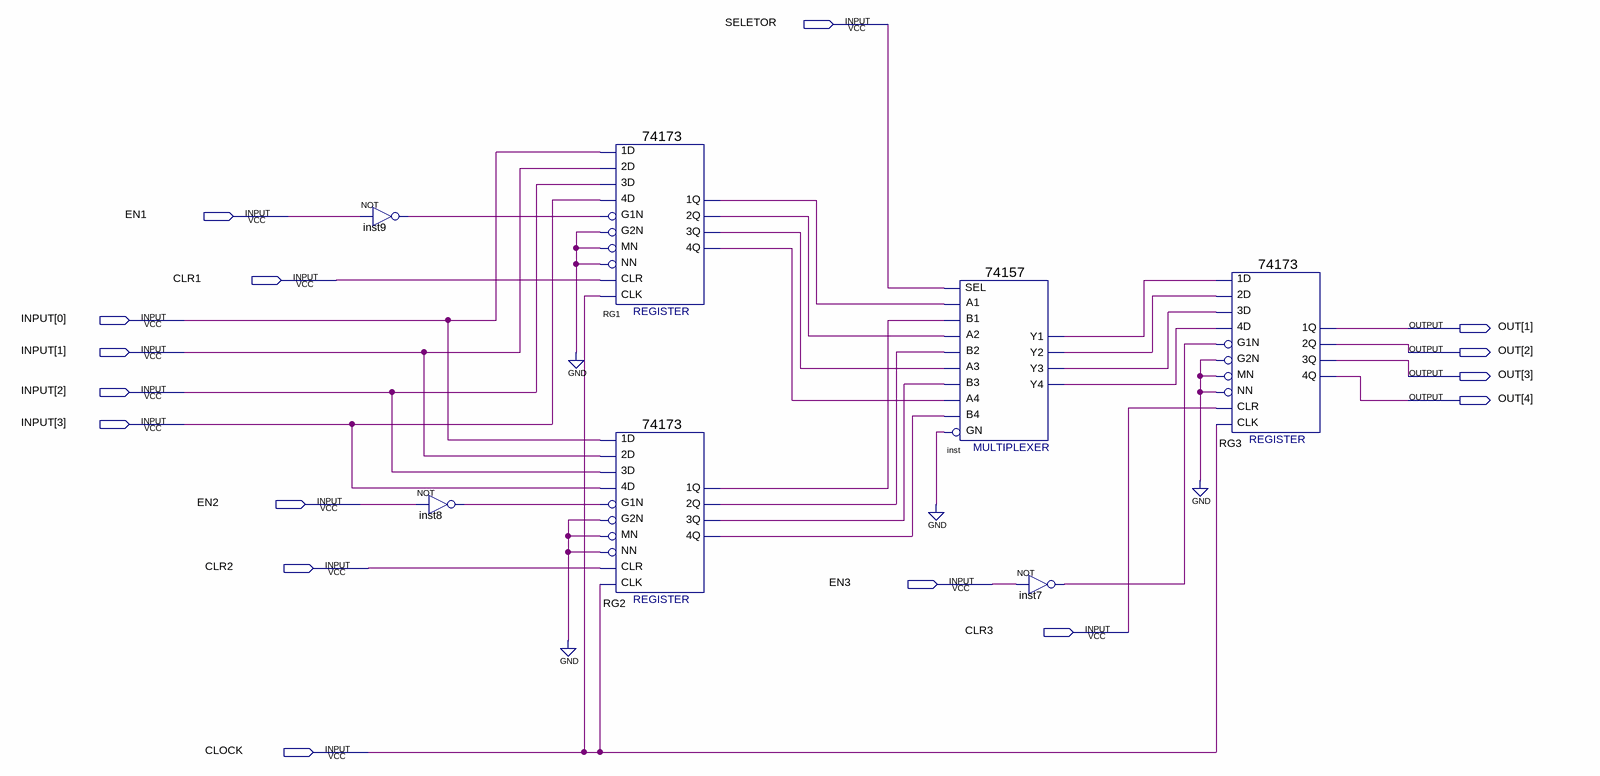
[diagram p0: schematic sheet]
// Quartus schematic Fluxo.bdf as structural Verilog: 7 symbols, 16 pins
module Fluxo (
  input  SELETOR,
  input  EN1,
  input  CLR1,
  input  [3:0] INPUT,
  input  EN2,
  input  CLR2,
  input  EN3,
  input  CLR3,
  input  CLOCK,
  output [4:1] OUT
);

  wire inst7_out, inst8_out, inst9_out, inst_y1, inst_y2, inst_y3, inst_y4, RG1_1q, RG1_2q, RG1_3q, RG1_4q,
       RG2_1q, RG2_2q, RG2_3q, RG2_4q;

  not inst9 (inst9_out, EN1);
  not inst8 (inst8_out, EN2);
  \74173  RG1 (
    .\3D (INPUT[2]), .MN(1'b0), .\1D (INPUT[0]), .\2D (INPUT[1]), .\4D (INPUT[3]), .G1N(inst9_out),
    .G2N(1'b0), .NN(1'b0), .CLR(CLR1), .CLK(CLOCK), .\3Q (RG1_3q), .\2Q (RG1_2q), .\1Q (RG1_1q), .\4Q (RG1_4q));
  \74173  RG2 (
    .\3D (INPUT[2]), .MN(1'b0), .\1D (INPUT[0]), .\2D (INPUT[1]), .\4D (INPUT[3]), .G1N(inst8_out),
    .G2N(1'b0), .NN(1'b0), .CLR(CLR2), .CLK(CLOCK), .\3Q (RG2_3q), .\2Q (RG2_2q), .\1Q (RG2_1q), .\4Q (RG2_4q));
  \74157  inst (
    .A1(RG1_1q), .B1(RG2_1q), .SEL(SELETOR), .B2(RG2_2q), .A3(RG1_3q), .B3(RG2_3q), .A2(RG1_2q), .B4(RG2_4q),
    .GN(1'b0), .A4(RG1_4q), .Y2(inst_y2), .Y1(inst_y1), .Y4(inst_y4), .Y3(inst_y3));
  not inst7 (inst7_out, EN3);
  \74173  RG3 (
    .\3D (inst_y3), .MN(1'b0), .\1D (inst_y1), .\2D (inst_y2), .\4D (inst_y4), .G1N(inst7_out), .G2N(1'b0),
    .NN(1'b0), .CLR(CLR3), .CLK(CLOCK), .\3Q (OUT[3]), .\2Q (OUT[2]), .\1Q (OUT[1]), .\4Q (OUT[4]));
endmodule
